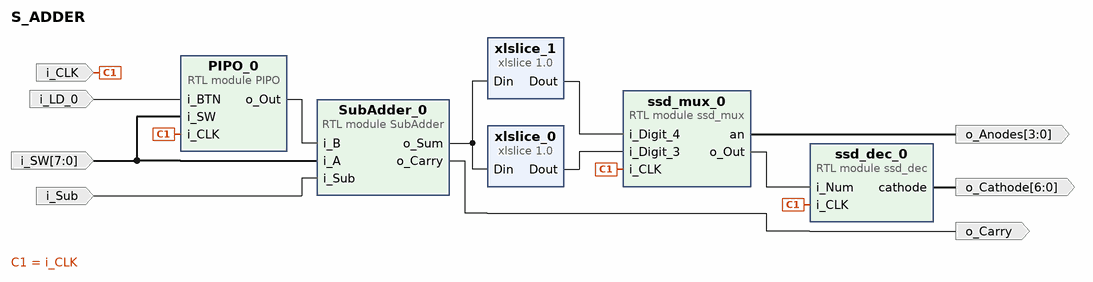
[diagram p0: block diagram of the top level]
# Vivado block design S_ADDER, xc7z007sclg400-1, Vivado 2018.2
create_bd_design S_ADDER

create_bd_port -dir I -type clk i_CLK
create_bd_port -dir I i_Sub
create_bd_port -dir O -from 3 -to 0 o_Anodes
create_bd_port -dir O -from 6 -to 0 o_Cathode
create_bd_port -dir I i_LD_0
create_bd_port -dir O o_Carry
create_bd_port -dir I -from 7 -to 0 i_SW

create_bd_cell -type module -reference ssd_mux ssd_mux_0
create_bd_cell -type module -reference ssd_dec ssd_dec_0
create_bd_cell -type ip -vlnv xilinx.com:ip:xlslice:1.0 xlslice_0
set_property -dict {CONFIG.DIN_TO 4 CONFIG.DIN_FROM 7 CONFIG.DIN_WIDTH 8 CONFIG.DOUT_WIDTH 4} [get_bd_cells xlslice_0]
create_bd_cell -type ip -vlnv xilinx.com:ip:xlslice:1.0 xlslice_1
set_property -dict {CONFIG.DIN_TO 0 CONFIG.DIN_FROM 3 CONFIG.DIN_WIDTH 8 CONFIG.DOUT_WIDTH 4} [get_bd_cells xlslice_1]
create_bd_cell -type module -reference PIPO PIPO_0
create_bd_cell -type module -reference SubAdder SubAdder_0

# ---- connections ----

connect_bd_net -net i_CLK_0_1 [get_bd_ports i_CLK] [get_bd_pins ssd_mux_0/i_CLK] [get_bd_pins ssd_dec_0/i_CLK] [get_bd_pins PIPO_0/i_CLK]
connect_bd_net -net i_Sub_0_1 [get_bd_ports i_Sub] [get_bd_pins SubAdder_0/i_Sub]
connect_bd_net [get_bd_pins SubAdder_0/o_Sum] [get_bd_pins xlslice_1/Din] [get_bd_pins xlslice_0/Din]
connect_bd_net [get_bd_pins ssd_mux_0/o_Out] [get_bd_pins ssd_dec_0/i_Num]
connect_bd_net [get_bd_pins ssd_mux_0/an] [get_bd_ports o_Anodes]
connect_bd_net [get_bd_pins ssd_dec_0/cathode] [get_bd_ports o_Cathode]
connect_bd_net [get_bd_pins PIPO_0/o_Out] [get_bd_pins SubAdder_0/i_B]
connect_bd_net -net i_BTN_0_1 [get_bd_ports i_LD_0] [get_bd_pins PIPO_0/i_BTN]
connect_bd_net [get_bd_pins SubAdder_0/o_Carry] [get_bd_ports o_Carry]
connect_bd_net [get_bd_ports i_SW] [get_bd_pins PIPO_0/i_SW] [get_bd_pins SubAdder_0/i_A]
connect_bd_net [get_bd_pins xlslice_1/Dout] [get_bd_pins ssd_mux_0/i_Digit_4]
connect_bd_net [get_bd_pins xlslice_0/Dout] [get_bd_pins ssd_mux_0/i_Digit_3]

validate_bd_design
save_bd_design
